# Altium schematic sheet uicc.SchDoc
size A3
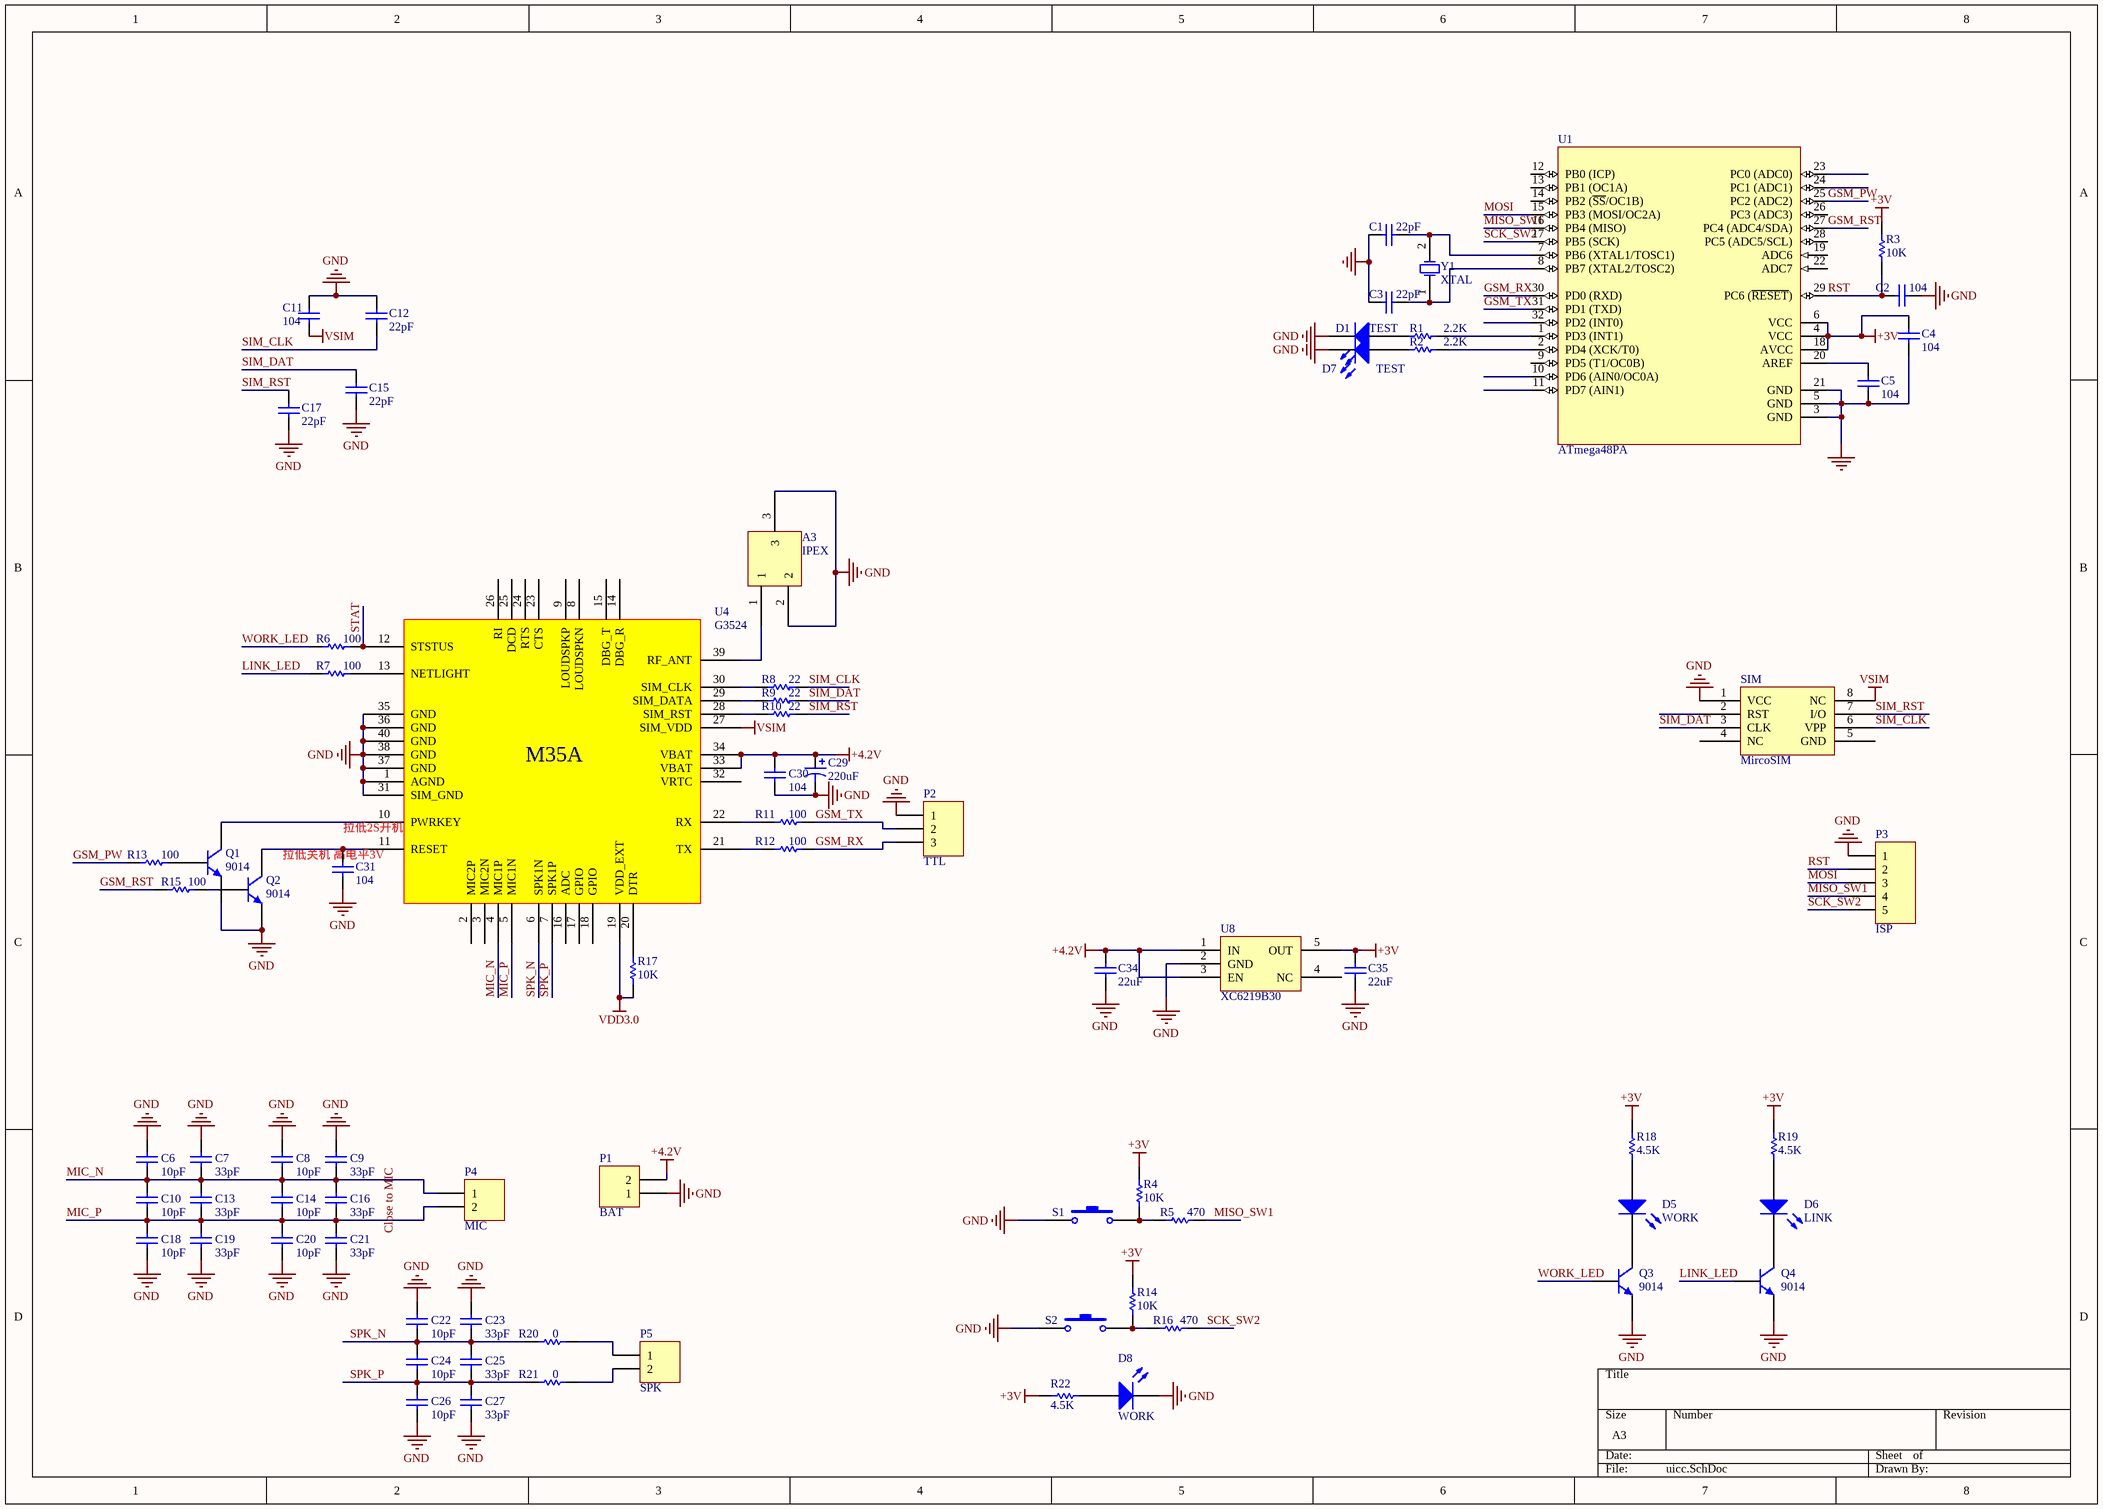
[diagram p0: uicc.SchDoc]

## Parts
A3  IPEX  [IPEX]
C1  value 22pF  [0603C]  (hidden comment: Cap)
C2  value 104  [0603C]  (hidden comment: Cap)
C3  value 22pF  [0603C]  (hidden comment: Cap)
C4  value 104  [0603C]  (hidden comment: Cap)
C5  value 104  [0603C]  (hidden comment: Cap)
C6  value 10pF  [0603R]  (hidden comment: Cap)
C7  value 33pF  [0603R]  (hidden comment: Cap)
C8  value 10pF  [0603R]  (hidden comment: Cap)
C9  value 33pF  [0603R]  (hidden comment: Cap)
C10  value 10pF  [0603R]  (hidden comment: Cap)
C11  value 104  [0603R]  (hidden comment: Cap)
C12  value 22pF  [0603R]  (hidden comment: Cap)
C13  value 33pF  [0603R]  (hidden comment: Cap)
C14  value 10pF  [0603R]  (hidden comment: Cap)
C15  value 22pF  [0603R]  (hidden comment: Cap)
C16  value 33pF  [0603R]  (hidden comment: Cap)
C17  value 22pF  [0603R]  (hidden comment: Cap)
C18  value 10pF  [0603R]  (hidden comment: Cap)
C19  value 33pF  [0603R]  (hidden comment: Cap)
C20  value 10pF  [0603R]  (hidden comment: Cap)
C21  value 33pF  [0603R]  (hidden comment: Cap)
C22  value 10pF  [0603R]  (hidden comment: Cap)
C23  value 33pF  [0603R]  (hidden comment: Cap)
C24  value 10pF  [0603R]  (hidden comment: Cap)
C25  value 33pF  [0603R]  (hidden comment: Cap)
C26  value 10pF  [0603R]  (hidden comment: Cap)
C27  value 33pF  [0603R]  (hidden comment: Cap)
C29  value 220uF  [C3216]  (hidden comment: Cap Pol3)
C30  value 104  [0603R]  (hidden comment: Cap)
C31  value 104  [0603R]  (hidden comment: Cap)
C34  value 22uF  [C1206]  (hidden comment: Cap)
C35  value 22uF  [C1206]  (hidden comment: Cap)
D1  TEST  [0603-LED]
D5  WORK  [0603-LED]
D6  LINK  [0603-LED]
D7  TEST  [0603-LED]
D8  WORK  [0603-LED]
P1  BAT  [PH2.0-2P]
P2  TTL  [HDR1X3]
P3  ISP  [HDR1X5]
P4  MIC  [PH2.0-2P]
P5  SPK  [PH2.0-2P]
Q1  value 9014  [SOT-23-NPN]  (hidden comment: NPN)
Q2  value 9014  [SOT-23-NPN]  (hidden comment: NPN)
Q3  value 9014  [SOT-23-NPN]  (hidden comment: NPN)
Q4  value 9014  [SOT-23-NPN]  (hidden comment: NPN)
R1  value 2.2K  [0603R]  (hidden comment: Res1)
R2  value 2.2K  [0603R]  (hidden comment: Res1)
R3  value 10K  [0603R]  (hidden comment: Res1)
R4  value 10K  [0603R]  (hidden comment: Res1)
R5  value 470  [0603R]  (hidden comment: Res1)
R6  value 100  [0603R]  (hidden comment: Res1)
R7  value 100  [0603R]  (hidden comment: Res1)
R8  value 22  [0603R]  (hidden comment: Res1)
R9  value 22  [0603R]  (hidden comment: Res1)
R10  value 22  [0603R]  (hidden comment: Res1)
R11  value 100  [0603R]  (hidden comment: Res1)
R12  value 100  [0603R]  (hidden comment: Res1)
R13  value 100  [0603R]  (hidden comment: Res1)
R14  value 10K  [0603R]  (hidden comment: Res1)
R15  value 100  [0603R]  (hidden comment: Res1)
R16  value 470  [0603R]  (hidden comment: Res1)
R17  value 10K  [0603R]  (hidden comment: Res1)
R18  value 4.5K  [0603R]  (hidden comment: Res1)
R19  value 4.5K  [0603R]  (hidden comment: Res1)
R20  value 0  [0603R]  (hidden comment: Res1)
R21  value 0  [0603R]  (hidden comment: Res1)
R22  value 4.5K  [0603R]  (hidden comment: Res1)
S1  SW-PB  [SW1]  (value not drawn)
S2  SW-PB  [SW1]  (value not drawn)
SIM  MircoSIM  [VQFN8]
U1  ATmega48PA  [32A_N]
U4  G3524  [G3524]
U8  XC6219B30  [SOT23-5N]
Y1  XTAL  [49SD]

## Nets
+3V: C4.2 C35.1 R3.2 R4.1 R14.1 R18.1 R19.1 R22.1 U1.4(VCC) U1.6(VCC) U1.18(AVCC) U8.5(OUT)
+4.2V: C29.1 C30.2 C34.1 P1.2 U4.33(VBAT) U4.34(VBAT) U8.1(IN) U8.3(EN)
GND: A3.2 A3.3 C1.2 C2.2 C3.2 C4.1 C5.2 C6.2 C7.2 C8.2 C9.2 C11.1 C12.1 C15.2 C17.2 C18.1 C19.1 C20.1 C21.1 C22.2 C23.2 C26.1 C27.1 C29.2 C30.1 C31.2 C34.2 C35.2 D1.2(K) D7.2(K) D8.2(K) P1.1 P2.1 P3.1 Q1.1(E) Q2.1(E) Q3.1(E) Q4.1(E) S1.1 S2.1 SIM.1(VCC) U1.3(GND) U1.5(GND) U1.21(GND) U4.1(AGND) U4.31(SIM_GND) U4.35(GND) U4.36(GND) U4.37(GND) U4.38(GND) U4.40(GND) U8.2(GND)
VDD3.0: R17.2 U4.19(VDD_EXT)
VSIM: C11.2 SIM.8(NC) U4.27(SIM_VDD)
GSM_PW: R13.2 U1.25(PC2_(ADC2))
GSM_RST: R15.2 U1.27(PC4_(ADC4/SDA))
GSM_RX: P2.3 R12.2 U1.30(PD0_(RXD))
GSM_TX: P2.2 R11.2 U1.31(PD1_(TXD))
LINK_LED: Q4.2(B) R7.2
MIC_N: C6.1 C7.1 C8.1 C9.1 C10.2 C13.2 C14.2 C16.2 P4.1 U4.4(MIC1P)
MIC_P: C10.1 C13.1 C14.1 C16.1 C18.2 C19.2 C20.2 C21.2 P4.2 U4.5(MIC1N)
MISO_SW1: P3.4 R5.2 U1.16(PB4_(MISO))
MOSI: P3.3 U1.15(PB3_(MOSI/OC2A))
RST: C2.1 P3.2 R3.1 U1.29(PC6_(~{RESET}))
SCK_SW2: P3.5 R16.2 U1.17(PB5_(SCK))
SIM_CLK: C12.2 R8.1 SIM.6(VPP)
SIM_DAT: C15.1 R9.1 SIM.3(CLK)
SIM_RST: C17.1 R10.1 SIM.7(I/O)
SPK_N: C22.1 C23.1 C24.2 C25.2 R20.1 U4.6(SPK1N)
SPK_P: C24.1 C25.1 C26.2 C27.2 R21.1 U4.7(SPK1P)
STAT: R6.1 U4.12(STSTUS)
WORK_LED: Q3.2(B) R6.2
NetA3_1: A3.1 U4.39(RF_ANT)
NetC1_1: C1.1 U1.7(PB6_(XTAL1/TOSC1)) Y1.2(OSC2)
NetC3_1: C3.1 U1.8(PB7_(XTAL2/TOSC2)) Y1.1(OSC1)
NetC5_1: C5.1 U1.20(AREF)
NetC31_1: C31.1 Q2.3(C) U4.11(RESET)
NetD1_1: D1.1(A) R1.2
NetD5_1: D5.1(A) R18.2
NetD5_2: D5.2(K) Q3.3(C)
NetD6_1: D6.1(A) R19.2
NetD6_2: D6.2(K) Q4.3(C)
NetD7_1: D7.1(A) R2.2
NetD8_1: D8.1(A) R22.2
NetP5_1: P5.1 R20.2
NetP5_2: P5.2 R21.2
NetQ1_2: Q1.2(B) R13.1
NetQ1_3: Q1.3(C) U4.10(PWRKEY)
NetQ2_2: Q2.2(B) R15.1
NetR1_1: R1.1 U1.1(PD3_(INT1))
NetR2_1: R2.1 U1.2(PD4_(XCK/T0))
NetR4_2: R4.2 R5.1 S1.2
NetR7_1: R7.1 U4.13(NETLIGHT)
NetR8_2: R8.2 U4.30(SIM_CLK)
NetR9_2: R9.2 U4.29(SIM_DATA)
NetR10_2: R10.2 U4.28(SIM_RST)
NetR11_1: R11.1 U4.22(RX)
NetR12_1: R12.1 U4.21(TX)
NetR14_2: R14.2 R16.1 S2.2
NetR17_1: R17.1 U4.20(DTR)

Not connected (* = marked no-connect by the designer): SIM 2(RST) 4(NC) 5(GND); U1 9(PD5_(T1/OC0B)) 10(PD6_(AIN0/OC0A)) 11(PD7_(AIN1)) 12(PB0_(ICP)) 13(PB1_(OC1A)) 14(PB2_(~{SS}/OC1B)) 19(ADC6) 22(ADC7) 23(PC0_(ADC0)) 24(PC1_(ADC1)) 26(PC3_(ADC3)) 28(PC5_(ADC5/SCL)) 32(PD2_(INT0)); U4 2(MIC2P) 3(MIC2N) 8(LOUDSPKN) 9(LOUDSPKP) 14(DBG_R) 15(DBG_T) 16(ADC) 17(GPIO) 18(GPIO) 23(CTS) 24(RTS) 25(DCD) 26(RI) 32(VRTC); U8 4(NC)

## Notes on the sheet
- (near C31) 拉低关机 高电平3V
- 拉低2S开机
- Labels drawn without touching a wire or pin: Close to MIC
- (in symbol G3524) M35A

## Library data of the parts
C1-C27 C30 C31 C34 C35 = Cap: Capacitor; Published: 8-Jun-2000; LatestRevisionDate: 17-Jul-2002; LatestRevisionNote: Re-released for DXP Platform.; PackageReference: RAD-0.3; Publisher: Altium Limited
C29 = Cap Pol3: Polarized Capacitor (Surface Mount); Published: 8-Jun-2000; LatestRevisionDate: 17-Jul-2002; LatestRevisionNote: Re-released for DXP Platform.; PackageReference: C0805; Publisher: Altium Limited
D1 D5-D8 = LED2: Typical RED, GREEN, YELLOW, AMBER GaAs LED; Value: GRN; Published: 8-Jun-2000; LatestRevisionDate: 17-Jul-2002; LatestRevisionNote: Re-released for DXP Platform.; PackageDocument: Feb-2002; PackageReference: 3.2X1.6X1.1; Publisher: Altium Limited
P1 P4 P5 = Header 2: Header, 2-Pin; LatestRevisionDate: 17-Jul-2002; LatestRevisionNote: Re-released for DXP Platform.; Publisher: Altium Limited
P2 = Header 3: Header, 3-Pin; LatestRevisionDate: 17-Jul-2002; LatestRevisionNote: Re-released for DXP Platform.; Publisher: Altium Limited
P3 = Header 5: Header, 5-Pin; LatestRevisionDate: 17-Jul-2002; LatestRevisionNote: Re-released for DXP Platform.; Publisher: Altium Limited
Q1-Q4 = 2N5551: NPN General Purpose Amplifier; Published: 8-Jun-2000; LatestRevisionDate: 17-Jan-2003; LatestRevisionNote: PCB Footprint 'BCY-W3/D4.7' replaced; DatasheetDocument: 1997; PackageDocument: Sep-1998; PackageReference: TO-92A; Publisher: Altium Limited; ComponentLink1Description: Manufacturer Link; ComponentLink1URL: http://www.fairchildsemi.com/; ComponentLink2Description: Datasheet; ComponentLink2URL: http://www.fairchildsemi.com/ds/2N%2F2N5551.pdf
R1-R22 = Res1: Resistor; Published: 8-Jun-2000; LatestRevisionDate: 17-Jul-2002; LatestRevisionNote: Re-released for DXP Platform.; PackageReference: AXIAL-0.3; Publisher: Altium Limited
S1 S2 = SW-PB: Switch; Published: 24-Mar-1999; LatestRevisionDate: 17-Jul-2002; LatestRevisionNote: Re-released for DXP Platform.; PackageReference: SPST-2; Publisher: Altium Limited
U1 = ATmega8-16AC: 8-Bit AVR Microcontroller with 8K Bytes of In-System Programmable Flash Memory; Published: 17-Sep-2003; LatestRevisionDate: 13-Apr-2006; LatestRevisionNote: IPC-7351 Footprint Added.; DatasheetVersion: 2486H-AVR-09/02; PackageVersion: revB, Oct-2001; PackageReference: 32A; Publisher: Altium Limited; PackageDescription: 32-Pin Thin Quad Flat Pack 0.8 mm Pitch; Code_JEDEC: MS-026-ABA; ComponentLink1Description: Manufacturer Link; ComponentLink1URL: http://www.atmel.com; ComponentLink2Description: Datasheet; ComponentLink2URL: http://www.atmel.com/dyn/resources/prod_documents/doc2486.pdf
U8 = LP5907: Value: LP5907
Y1 = XTAL: Crystal Oscillator; Published: 8-Jun-2000; LatestRevisionDate: 17-Jul-2002; LatestRevisionNote: Re-released for DXP Platform.; PackageReference: R38; Publisher: Altium Limited